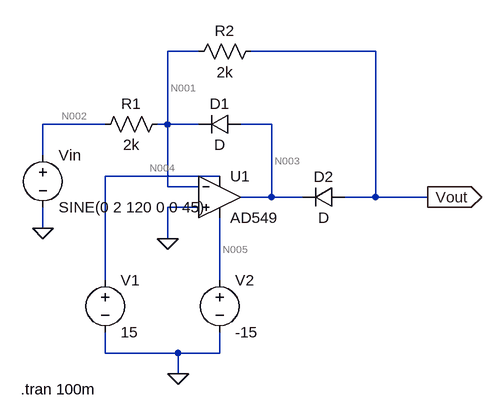
[diagram p0: schematic Draft1.asc]
Draft1.asc, the LTspice schematic file:
Version 4
SHEET 1 880 680
WIRE 288 -64 240 -64
WIRE 560 -64 368 -64
WIRE 144 48 48 48
WIRE 240 48 240 -64
WIRE 240 48 224 48
WIRE 288 48 240 48
WIRE 400 48 352 48
WIRE 48 96 48 48
WIRE 320 128 144 128
WIRE 240 144 240 48
WIRE 288 144 240 144
WIRE 400 160 400 48
WIRE 400 160 352 160
WIRE 448 160 400 160
WIRE 560 160 560 -64
WIRE 560 160 512 160
WIRE 640 160 560 160
WIRE 288 176 240 176
WIRE 48 208 48 176
WIRE 240 224 240 176
WIRE 144 288 144 128
WIRE 320 288 320 192
WIRE 144 400 144 368
WIRE 256 400 144 400
WIRE 320 400 320 368
WIRE 320 400 256 400
WIRE 256 432 256 400
FLAG 240 224 0
FLAG 48 208 0
FLAG 640 160 Vout
IOPIN 640 160 Out
FLAG 256 432 0
SYMBOL voltage 48 80 R0
WINDOW 123 0 0 Left 0
WINDOW 39 0 0 Left 0
SYMATTR InstName Vin
SYMATTR Value SINE(0 2 120 0 0 45)
SYMBOL res 240 32 R90
WINDOW 0 0 56 VBottom 2
WINDOW 3 32 56 VTop 2
SYMATTR InstName R1
SYMATTR Value 2k
SYMBOL res 384 -80 R90
WINDOW 0 0 56 VBottom 2
WINDOW 3 32 56 VTop 2
SYMATTR InstName R2
SYMATTR Value 2k
SYMBOL diode 352 32 R90
WINDOW 0 0 32 VBottom 2
WINDOW 3 32 32 VTop 2
SYMATTR InstName D1
SYMBOL Opamps\\AD549 320 96 R0
SYMATTR InstName U1
SYMBOL diode 512 144 R90
WINDOW 0 0 32 VBottom 2
WINDOW 3 32 32 VTop 2
SYMATTR InstName D2
SYMBOL voltage 144 272 R0
SYMATTR InstName V1
SYMATTR Value 15
SYMBOL voltage 320 272 R0
SYMATTR InstName V2
SYMATTR Value -15
TEXT 14 456 Left 2 !.tran 100m

The netlist it stands for:
* Draft1.asc
Vin N002 0 SINE(0 2 120 0 0 45)
R1 N001 N002 2k
R2 Vout N001 2k
D1 N003 N001 D
XU1 0 N001 N004 N005 N003 AD549  ; pins In+ In- V+ V- OUT
D2 Vout N003 D
V1 N004 0 15
V2 N005 0 -15
.model D D
.lib standard.dio
.tran 100m
.backanno
.end

* Results of the author's LTspice run, read from the files saved beside the schematic
* Operating Point, zero values left out:
*   V(n002) = 1.414 V
*   V(n001) = 1.666 µV
*   V(vout) = -1.414 V
*   V(n003) = -2.06 V
*   V(n004) = 15 V
*   V(n005) = -15 V
*   I(D2) = 707.1 µA
*   I(D1) = -2.07 pA
*   I(R2) = -707.1 µA
*   I(R1) = -707.1 µA
*   I(V2) = 1.07 mA
*   I(V1) = -363.1 µA
*   I(Vin) = -707.1 µA
*   Ix(u1:3) = 363.1 µA
*   Ix(u1:4) = -1.07 mA
*   Ix(u1:5) = 707.1 µA
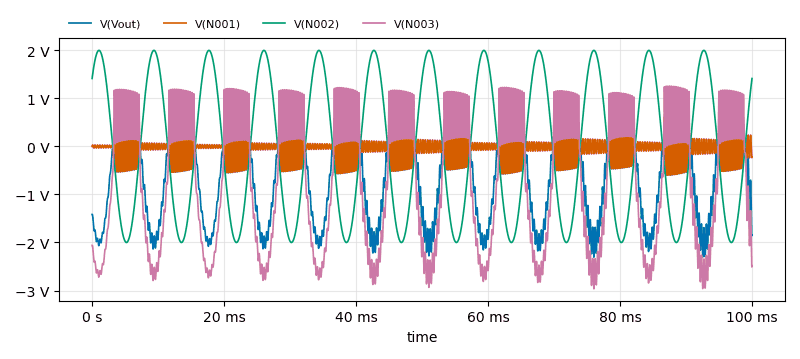
[diagram p1: Transient Analysis of Draft1.asc, plotted from the saved traces]
* Transient Analysis, 1 run:
*   V(Vout): min -2.307 V, max 609.7 mV, average -637.8 mV, rms 1.037 V, last -1.843 V
*   V(N001): min -598.4 mV, max 609.7 mV, average -7.792 µV, rms 248.9 mV, last -214.3 mV
*   V(N002): min -2 V, max 2 V, average -5.649 µV, rms 1.414 V, last 1.414 V
*   V(N003): min -2.964 V, max 1.258 V, average -659.4 mV, rms 1.519 V, last -2.493 V